# Altium schematic sheet Switch.SchDoc
size B
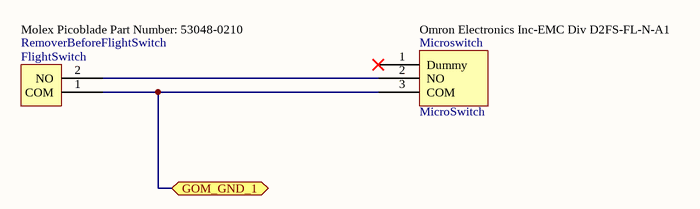
[diagram p0: Switch.SchDoc]

## Parts
FlightSwitch  RemoverBeforeFlightSwitch  [RemoverBeforeFlight Switch]
Microswitch  MicroSwitch  [MicroSwitch_3pin]

## Ports
GOM_GND_1 (bidir)

## Nets
GOM_GND_1: FlightSwitch.1(COM) Microswitch.3(COM) ; port GOM_GND_1
NetFlightSwitch_2: FlightSwitch.2(NO) Microswitch.2(NO)

Not connected (* = marked no-connect by the designer): Microswitch 1(Dummy)*

## Notes on the sheet
- (near FlightSwitch) Molex Picoblade Part Number: 53048-0210
- (near Microswitch) Omron Electronics Inc-EMC Div D2FS-FL-N-A1

## Library data of the parts
FlightSwitch = RemoverBeforeFlightSwitch: 53048-0210 Molex Picoblade
Microswitch = MicroSwitch: Omron Electronics Inc-EMC Div D2FS-FL-N-A1